# Altium project 全联供主板_V1.0.PrjPCB
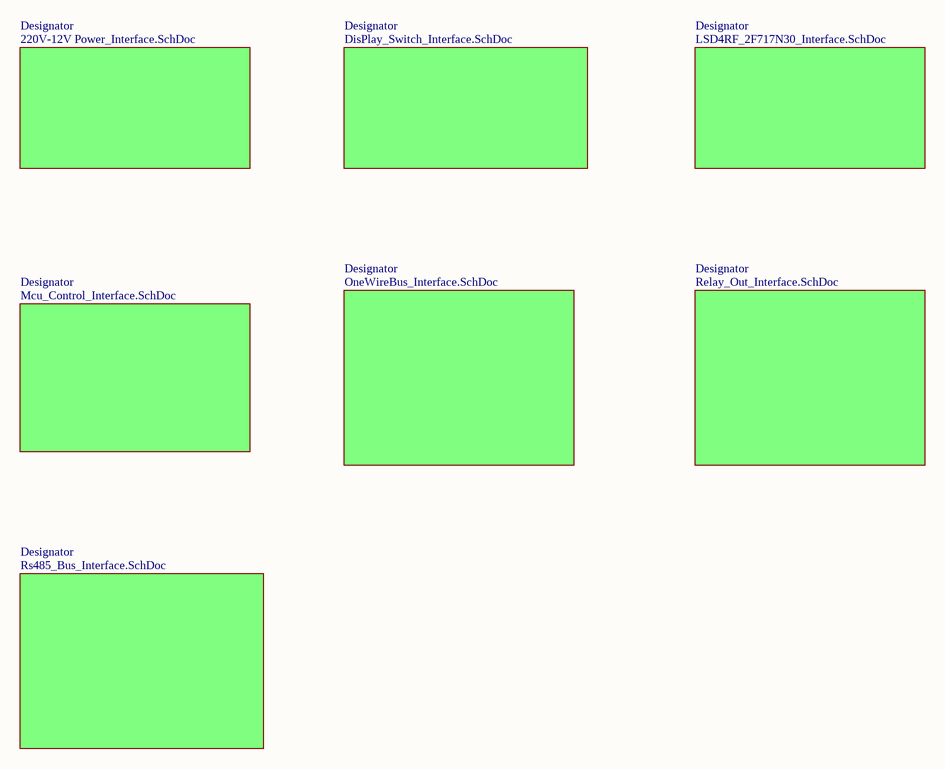
[diagram p0: 2019_Box_MainBoard_sch.SchDoc]
6 sheets, 122 parts. Net scope: global (net labels, ports and power ports of the same name join across sheets).
Board files: 10515.0462_全联供主板_V1.0.PcbDoc, 10515.0462_全联供主板(2拼版)_V1.0.PcbDoc
Sheets:
  2019_Box_MainBoard_sch.SchDoc
    Designator = 220V-12V Power_Interface.SchDoc
    Designator = DisPlay_Switch_Interface.SchDoc
    Designator = LSD4RF_2F717N30_Interface.SchDoc
    Designator = OneWireBus_Interface.SchDoc
    Designator = Rs485_Bus_Interface.SchDoc

## Sheet 2019_Box_MainBoard_sch.SchDoc
size A3

### Sub-sheets
Designator = 220V-12V Power_Interface.SchDoc: no entries
Designator = DisPlay_Switch_Interface.SchDoc: no entries
Designator = LSD4RF_2F717N30_Interface.SchDoc: no entries
Designator = Mcu_Control_Interface.SchDoc (file not in this document): no entries
Designator = OneWireBus_Interface.SchDoc: no entries
Designator = Relay_Out_Interface.SchDoc (file not in this document): no entries
Designator = Rs485_Bus_Interface.SchDoc: no entries

## Sheet 220V-12V Power_Interface.SchDoc
size A4
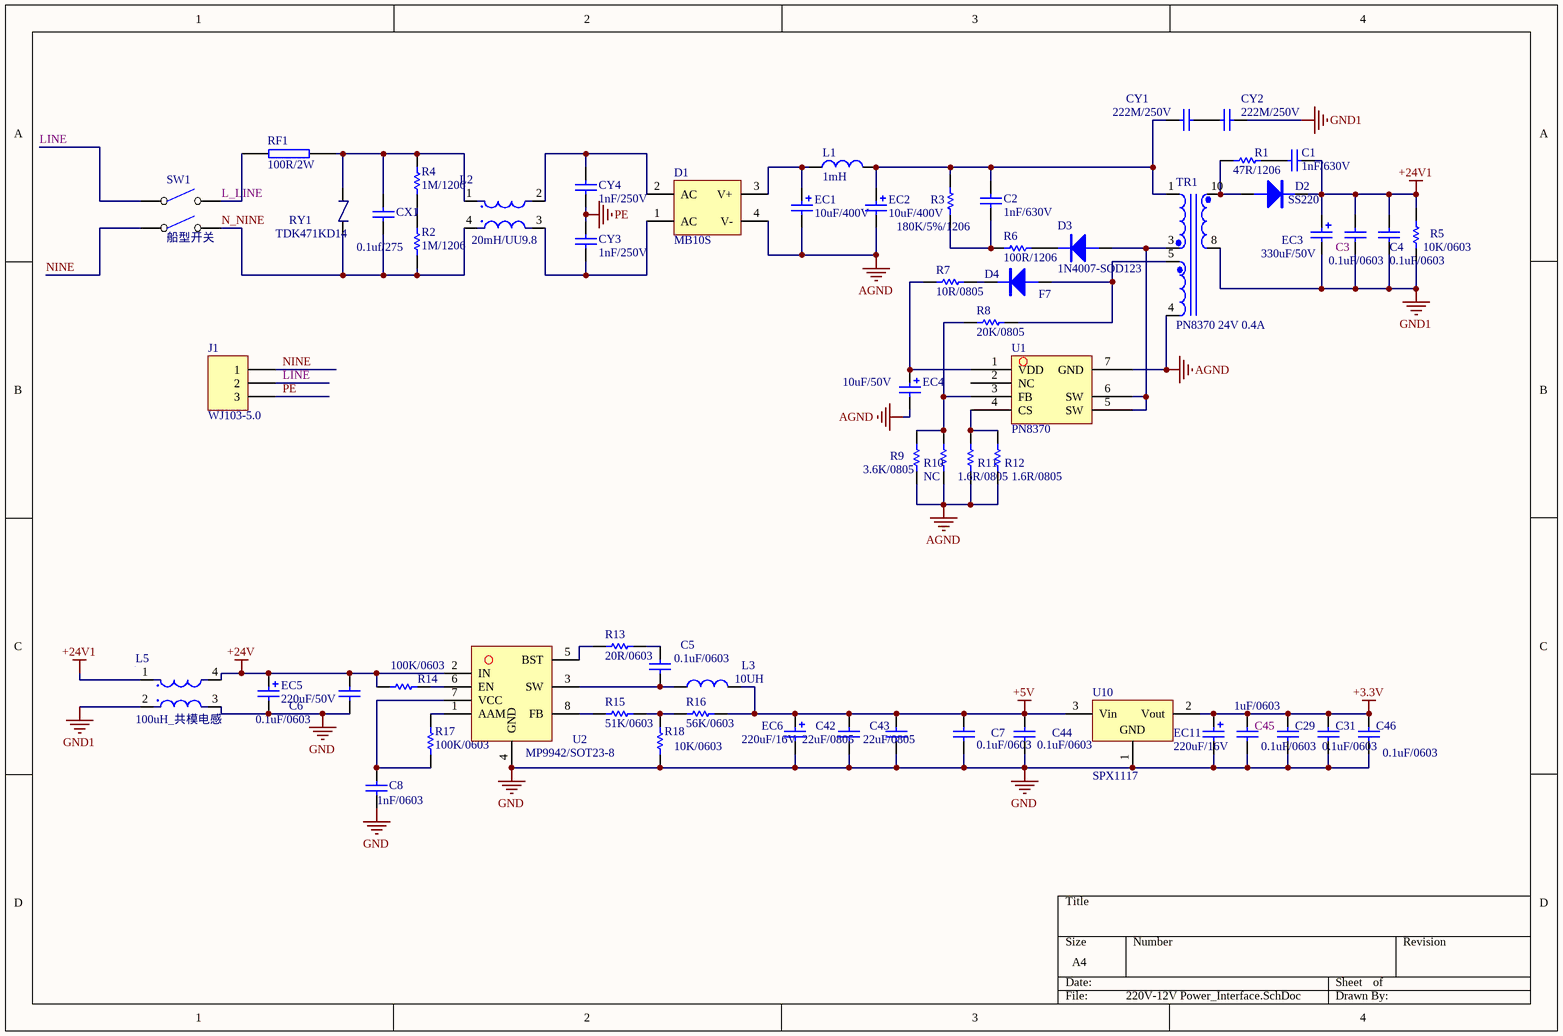
[diagram p1: 220V-12V Power_Interface.SchDoc]

### Parts
C1  1nF/630V  [CAP/SMT/1206C]
C2  1nF/630V  [CAP/SMT/1206C]
C3  0.1uF/0603  [CAP/SMT/0603C]
C4  0.1uF/0603  [CAP/SMT/0603C]
C5  0.1uF/0603  [CAP/SMT/0603C]
C6  0.1uF/0603  [CAP/SMT/0603C]
C7  0.1uF/0603  [CAP/SMT/0603C]
C8  1nF/0603  [CAP/SMT/0603C]
C29  0.1uF/0603  [CAP/SMT/0603C]
C31  0.1uF/0603  [CAP/SMT/0603C]
C42  22uF/0805  [CAP/SMT/0805C]
C43  22uF/0805  [CAP/SMT/0805C]
C44  0.1uF/0603  [CAP/SMT/0603C]
C45  1uF/0603  [CAP/SMT/0603C]
C46  0.1uF/0603  [CAP/SMT/0603C]
CX1  0.1uf/275  [CAP/DIP/0.1uF/250V]
CY1  222M/250V  [CAP/DIP/102M/250V]
CY2  222M/250V  [CAP/DIP/102M/250V]
CY3  1nF/250V  [CAP/DIP/102M/250V]
CY4  1nF/250V  [CAP/DIP/102M/250V]
D1  MB10S  [D/SMT/MD6S-TR]
D2  SS220  [D/SMT/DO-214AC]
D3  1N4007-SOD123  [D/SMT/SOD123]
D4  F7  [D/SMT/DO-214AC]
EC1  10uF/400V  [CAP/DIP/6.8UF/400V/10MM]
EC2  10uF/400V  [CAP/DIP/6.8UF/400V/10MM]
EC3  330uF/50V  [CAP/SMT/220UF/50V]
EC4  10uF/50V  [CAP/DIP/10uF/50V]
EC5  220uF/50V  [CAP/SMT/220UF/50V]
EC6  220uF/16V  [CAP/SMT/220UF/16V]
EC11  220uF/16V  [CAP/SMT/100UF/25V]
J1  WJ103-5.0  [CON/DIP/1×3PIN/5.0MM/WJ103-3P]
L1  1mH  [L/DIP/1mH]
L2  20mH/UU9.8  [L/DIP/20mH/UU9.8]
L3  10UH  [L/SMT/SWPA3015S150MT]
L5  100uH_共模电感  [L/DIP/500uH]
R1  47R/1206  [1206R]
R2  1M/1206  [1206R]
R3  180K/5%/1206  [1206R]
R4  1M/1206  [1206R]
R5  10K/0603  [0603R]
R6  100R/1206  [1206R]
R7  10R/0805  [0805R]
R8  20K/0805  [0805R]
R9  3.6K/0805  [0805R]
R10  NC  [0805R]
R11  1.6R/0805  [0805R]
R12  1.6R/0805  [0805R]
R13  20R/0603  [0603R]
R14  100K/0603  [0603R]
R15  51K/0603  [0603R]
R16  56K/0603  [0603R]
R17  100K/0603  [0603R]
R18  10K/0603  [0603R]
RF1  100R/2W  [FUSE/3.15A]
RY1  TDK471KD14  [RES/RY/TDK471KD14]
SW1  船型开关  [DIP4 - duplicate]
TR1  PN8370 24V 0.4A  [L/TRANS/DIP/PN8370 24V 0.4A]
U1  PN8370  [SOP-7]
U2  MP9942/SOT23-8  [TSOT-8]
U10  SPX1117  [SOT-223]

### Nets
+3.3V: C29.2 C31.2 C45.2 C46.2 EC11.1 U10.2(Vout)
+5V: C7.2 C42.2 C43.2 C44.2 EC6.1 L3.2 R16.2 U10.3(Vin)
+24V: C6.1 EC5.1 L5.4 R14.1 U2.2(IN)
+24V1: C1.2 C3.1 C4.1 D2.1(K) EC3.1 L5.1 R5.2
AGND: D1.4(V-) EC1.2 EC2.2 EC4.2 R9.1 R10.1 R11.1 R12.1 TR1.4 U1.7(GND)
GND: C6.2 C7.1 C8.2 C29.1 C31.1 C42.1 C43.1 C44.1 C45.1 C46.1 EC5.2 EC6.2 EC11.2 L5.3 R18.2 U2.4(GND) U10.1(GND)
GND1: C3.2 C4.2 CY2.2 EC3.2 L5.2 R5.1 TR1.8
PE: CY3.1 CY4.2 J1.3
L_LINE: RF1.2 SW1.1
LINE: J1.2 SW1.2
N_NINE: CX1.2 L2.4 R2.1 RY1.1 SW1.3
NINE: J1.1 SW1.4
NetC1_1: C1.1 R1.2
NetC2_1: C2.1 R3.1 R6.2
NetC2_2: C2.2 CY1.1 EC2.1 L1.2 R3.2 TR1.1
NetC5_1: C5.1 R13.1
NetC5_2: C5.2 L3.1 U2.3(SW)
NetC8_1: C8.1 R17.1 U2.7(VCC)
NetCX1_1: CX1.1 L2.1 R4.2 RF1.1 RY1.2
NetCY1_2: CY1.2 CY2.1
NetCY3_2: CY3.2 D1.1(AC) L2.3
NetCY4_1: CY4.1 D1.2(AC) L2.2
NetD1_3: D1.3(V+) EC1.1 L1.1
NetD2_2: D2.2(A) R1.1 TR1.10
NetD3_1: D3.1(K) R6.1
NetD3_2: D3.2(A) TR1.3 U1.5(SW) U1.6(SW)
NetD4_1: D4.1(K) R7.2
NetD4_2: D4.2(A) R8.2 TR1.5
NetEC4_1: EC4.1 R7.1 U1.1(VDD)
NetR2_2: R2.2 R4.1
NetR8_1: R8.1 R9.2 R10.2 U1.3(FB)
NetR11_2: R11.2 R12.2 U1.4(CS)
NetR13_2: R13.2 U2.5(BST)
NetR14_2: R14.2 U2.6(EN)
NetR15_1: R15.1 U2.8(FB)
NetR15_2: R15.2 R16.1 R18.1
NetR17_2: R17.2 U2.1(AAM)

Not connected (* = marked no-connect by the designer): U1 2(NC)

### Library data of the parts
C1 C2 = CAP/CAP/SMT/1206C
C3-C8 C29 C31 C44-C46 = CAP/CAP/SMT/0603C
C42 C43 = CAP/CAP/SMT/0805C
CX1 = CAP/DIP/0.1uF/275V
CY1-CY4 = CAP/DIP/102M/250V
D1 = D/BRIDGE/SMT/MB10S: D_Bridge
D2 = D/D/SMT/SS210/DO-214
D3 = D/D/SMT/1N4007-SOD123
D4 = D/D/SMT/FFM107/DO-214
EC1 EC2 = CAP/AEC/DIP/6.8uF/400V
EC3 = CAP/AEC/DIP/330uF/25V
EC4 = CAP/AEC/DIP/10uF/50V
EC5 = CAP/AEC/SMT/220uF/50V
EC6 = CAP/AEC/SMT/220uF/16V
EC11 = CAP/AEC/SMT/100uF/25V
J1 = CON/DIP/1X3PIN/WJ103-5.0MM: Connector
L1 = L/L/DIP/JYGX68-1.0mH/300mA: 工字电感
L2 = L/L/DIP/20mH: 共模电感
L3 = L/L/SMT/SWPA3015S150MT: 电感3.0MM*3.0MM*1.5MM
L5 = L/L/DIP/100uH_共模电感: 共模电感
R1-R4 R6 = RES/RES/SMT/1206
R5 R13-R18 = RES/RES/SMT/0603
R7-R12 = RES/RES/SMT/0805
RF1 = FUSE/FUSE/DIP/3.15A
RY1 = RES/RY/DIP/TDK471KD14
SW1 = SWITCH/POWER/DIP/船型开关
TR1 = L/TRANS/DIP/PN8370 24V 0.4A
U1 = IC/POWER/SMT/PN8366/SOP-8
U2 = IC/POWER/SMT/MPS2314/SOT23-8
U10 = IC/POWER/SMT/SPX1117M3-L3.3TR/SOT-223: Manufacturer: Generic Components; Class: Power Management; SubClass: Voltage Regulator; Published: 1999

## Sheet DisPlay_Switch_Interface.SchDoc
size A4
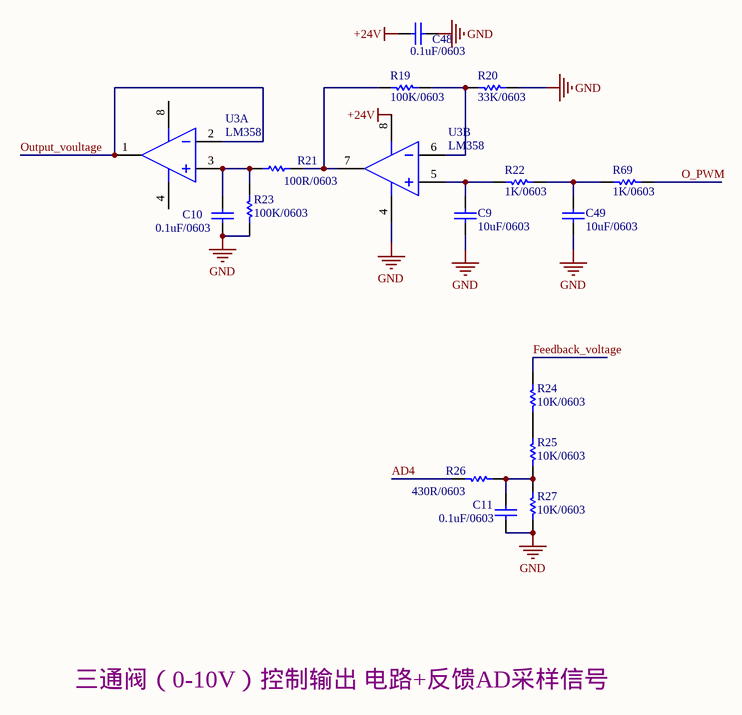
[diagram p2: DisPlay_Switch_Interface.SchDoc]

### Parts
C9  10uF/0603  [CAP/SMT/0603C]
C10  0.1uF/0603  [CAP/SMT/0603C]
C11  0.1uF/0603  [CAP/SMT/0603C]
C48  0.1uF/0603  [CAP/SMT/0603C]
C49  10uF/0603  [CAP/SMT/0603C]
R19  100K/0603  [0603R]
R20  33K/0603  [0603R]
R21  100R/0603  [0603R]
R22  1K/0603  [0603R]
R23  100K/0603  [0603R]
R24  10K/0603  [0603R]
R25  10K/0603  [0603R]
R26  430R/0603  [0603R]
R27  10K/0603  [0603R]
R69  1K/0603  [0603R]
U3  LM358  [SOIC-8]  (parts A,B of 2)

### Nets
+24V: C48.2 U3.8(VCC)
GND: C9.1 C10.1 C11.1 C48.1 C49.1 R20.1 R23.2 R27.1 U3.4(GND)
AD4: R26.1
Feedback_voltage: R24.2
O_PWM: R69.1
Output_voultage: U3.1(OUT) U3.2(IN-)
NetC9_2: C9.2 R22.2 U3.5(IN+)
NetC10_2: C10.2 R21.1 R23.1 U3.3(IN+)
NetC11_2: C11.2 R25.1 R26.2 R27.2
NetC49_2: C49.2 R22.1 R69.2
NetR19_1: R19.1 R20.2 U3.6(IN-)
NetR19_2: R19.2 R21.2 U3.7(OUT)
NetR24_1: R24.1 R25.2

### Notes on the sheet
- Labels drawn without touching a wire or pin: 三通阀（0-10V）控制输出 电路+反馈AD采样信号

### Library data of the parts
C9-C11 C48 C49 = CAP/CAP/SMT/0603C
R19-R27 R69 = RES/RES/SMT/0603
U3 = IC/OP/SMT/SGM358YS/SOIC-8: 1MHz 60uA Rail-to-Rail i/o CMOS OP; Manufacturer: ST-Microelectronics; Class: Analog; SubClass: Comparator; Published: 24/08/2001; Publisher: Altium Hobart Technology Centre

## Sheet LSD4RF_2F717N30_Interface.SchDoc
size A4
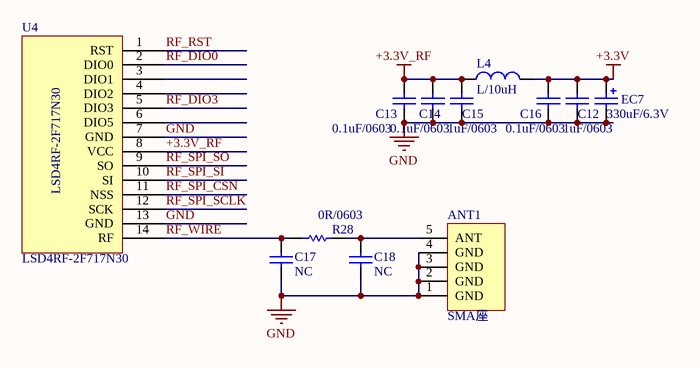
[diagram p3: LSD4RF_2F717N30_Interface.SchDoc]

### Parts
ANT1  SMA座  [SMA]
C12  1uF/0603  [CAP/SMT/0603C]
C13  0.1uF/0603  [CAP/SMT/0603C]
C14  0.1uF/0603  [CAP/SMT/0603C]
C15  1uF/0603  [CAP/SMT/0603C]
C16  0.1uF/0603  [CAP/SMT/0603C]
C17  NC  [CAP/SMT/0603C]
C18  NC  [CAP/SMT/0603C]
EC7  330uF/6.3V  [CAP/SMT/330UF/6.3V]
L4  L/10uH  [L/SMT/0603L]
R28  0R/0603  [0603R]
U4  LSD4RF-2F717N30  [MODEL/LSD4RF-2F717N30]

### Nets
+3.3V: C12.2 C16.1 EC7.1 L4.2
+3.3V_RF: C13.1 C14.1 C15.1 L4.1 U4.8(VCC)
GND: ANT1.1(GND) ANT1.2(GND) ANT1.3(GND) ANT1.4(GND) C12.1 C13.2 C14.2 C15.2 C16.2 C17.1 C18.1 EC7.2 U4.7(GND) U4.13(GND)
RF_DIO0: U4.2(DIO0)
RF_DIO3: U4.5(DIO3)
RF_RST: U4.1(RST)
RF_SPI_CSN: U4.11(NSS)
RF_SPI_SCLK: U4.12(SCK)
RF_SPI_SI: U4.10(SI)
RF_SPI_SO: U4.9(SO)
RF_WIRE: C17.2 R28.1 U4.14(RF)
NetANT1_5: ANT1.5(ANT) C18.2 R28.2

Not connected (* = marked no-connect by the designer): U4 3(DIO1) 4(DIO2) 6(DIO5)

### Library data of the parts
ANT1 = OTHER/Antena/SMA座
C12-C18 = CAP/CAP/SMT/0603C
EC7 = CAP/AEC/SMT/330uF/6.3V
L4 = L/BEAD/SMT/0603L
R28 = RES/RES/SMT/0603
U4 = MODLE/RF/LSD4RF-2F717N30

## Sheet OneWireBus_Interface.SchDoc
size A4
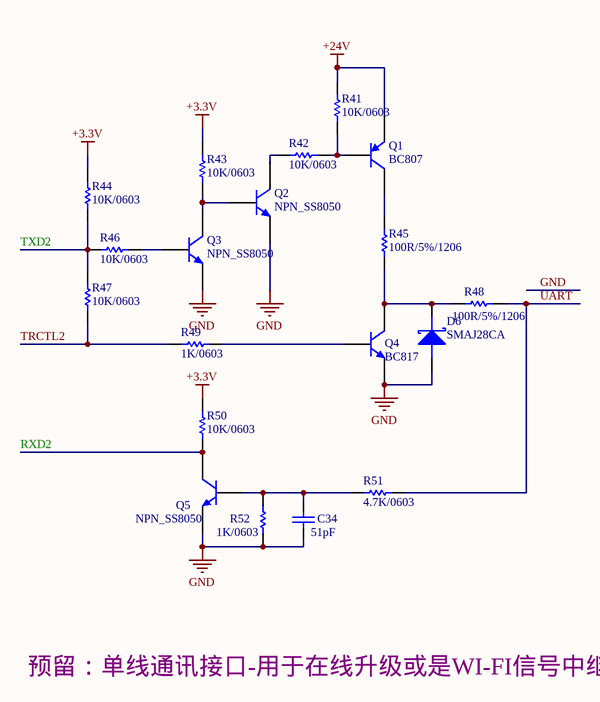
[diagram p4: OneWireBus_Interface.SchDoc]

### Parts
C34  51pF  [CAP/SMT/0603C]
D6  SMAJ28CA  [D/SMT/SMBJ4.0A]
Q1  BC807  [BJT/SMT/SOT-23]
Q2  NPN_SS8050  [BJT/SMT/SOT-23]
Q3  NPN_SS8050  [BJT/SMT/SOT-23]
Q4  BC817  [BJT/SMT/SOT-23]
Q5  NPN_SS8050  [BJT/SMT/SOT-23]
R41  10K/0603  [0603R]
R42  10K/0603  [0603R]
R43  10K/0603  [0603R]
R44  10K/0603  [0603R]
R45  100R/5%/1206  [1206R]
R46  10K/0603  [0603R]
R47  10K/0603  [0603R]
R48  100R/5%/1206  [1206R]
R49  1K/0603  [0603R]
R50  10K/0603  [0603R]
R51  4.7K/0603  [0603R]
R52  1K/0603  [0603R]

### Nets
+3.3V: R43.2 R44.1 R50.2
+24V: Q1.2(E) R41.2
GND: C34.1 D6.1(K) Q2.2(E) Q3.2(E) Q4.2(E) Q5.2(E) R52.2
RXD2: Q5.3(C) R50.1
TRCTL2: R47.2 R49.2
TXD2: R44.2 R46.2 R47.1
UART: R48.1 R51.2
NetC34_2: C34.2 Q5.1(B) R51.1 R52.1
NetD6_2: D6.2(A) Q4.3(C) R45.1 R48.2
NetQ1_1: Q1.1(B) R41.1 R42.1
NetQ1_3: Q1.3(C) R45.2
NetQ2_1: Q2.1(B) Q3.3(C) R43.1
NetQ2_3: Q2.3(C) R42.2
NetQ3_1: Q3.1(B) R46.1
NetQ4_1: Q4.1(B) R49.1

### Notes on the sheet
- Labels drawn without touching a wire or pin: 预留：单线通讯接口-用于在线升级或是WI-FI信号中继

### Library data of the parts
C34 = A_Cap_0805: Manufacturer: Generic Components; Class: Passive; SubClass: Capacitor; Value: 100pF; Published: 08/06/2000; Publisher: Altium Hobart Technology Centre
D6 = D/TVS/SMT/SMBJ6.5A/DO-214
Q1 = PNP: PNP Bipolar Transistor; Published: 8-Jun-2000; LatestRevisionDate: 29-May-2009; LatestRevisionNote: IPC-7351 Footprint Added.; PackageVersion: Aug-1999; PackageReference: SOT-23B; Publisher: Altium Limited; PackageDescription: 3-Pin SOT-23 Package 0.95 mm Pitch, 2.4 mm Lead Span
Q2-Q5 = BJT/NPN/SMT/SS8050/SOT-23: Vce25V/Vcb40V/Veb5V/Ic1.5V/Pd300mW; Published: *; Publisher: *; Manufacturer: *; Class: *; SubClass: *
R41-R44 R46 R47 R49-R52 = A_Res_0805: Resistor; Manufacturer: Generic Components; Class: Passive; Value: 1K; Published: 08/06/2000; Publisher: Altium Hobart Technology Centre; SubClass: Resistor
R45 R48 = RES/RES/SMT/1206

## Sheet Rs485_Bus_Interface.SchDoc
size A4
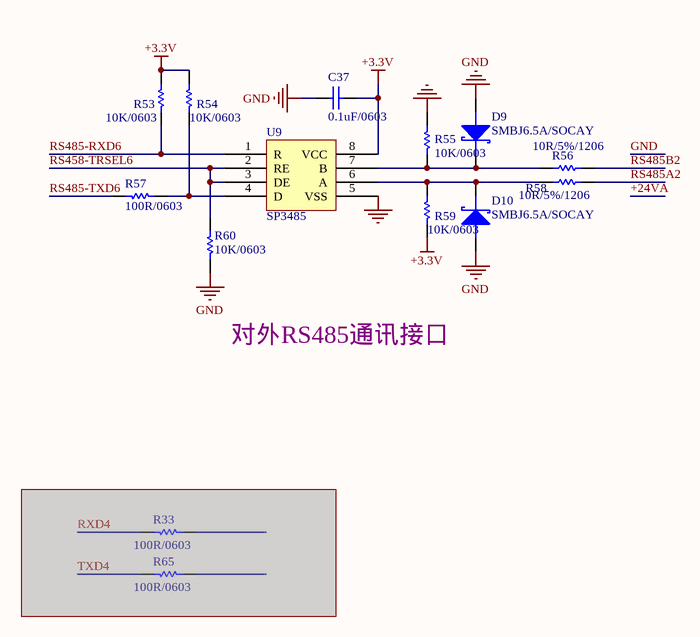
[diagram p5: Rs485_Bus_Interface.SchDoc]

### Parts
C37  0.1uF/0603  [CAP/SMT/0603C]
D9  SMBJ6.5A/SOCAY  [D/SMT/SMBJ4.0A]
D10  SMBJ6.5A/SOCAY  [D/SMT/SMBJ4.0A]
R33  100R/0603  [0603R]  (masked out: inside a compile mask, not in the netlist)
R53  10K/0603  [0603R]
R54  10K/0603  [0603R]
R55  10K/0603  [0603R]
R56  10R/5%/1206  [1206R]
R57  100R/0603  [0603R]
R58  10R/5%/1206  [1206R]
R59  10K/0603  [0603R]
R60  10K/0603  [0603R]
R65  100R/0603  [0603R]  (masked out: inside a compile mask, not in the netlist)
U9  SP3485  [SOP-8]

### Nets
+3.3V: C37.2 R53.2 R54.2 R59.2 U9.8(VCC)
GND: C37.1 D9.1(K) D10.1(K) R55.1 R60.1 U9.5(VSS)
RS458-TRSEL6: R60.2 U9.2(RE) U9.3(DE)
RS485-RXD6: R53.1 U9.1(R)
RS485-TXD6: R57.2
RS485A2: R58.2
RS485B2: R56.2
NetD9_2: D9.2(A) R55.2 R56.1 U9.7(B)
NetD10_2: D10.2(A) R58.1 R59.1 U9.6(A)
NetR54_1: R54.1 R57.1 U9.4(D)

### Notes on the sheet
- Labels drawn without touching a wire or pin: 对外RS485通讯接口

### Library data of the parts
C37 = CAP/CAP/SMT/0603C
D9 D10 = D/TVS/SMT/SMBJ6.5A/DO-214
R33 R53-R55 R57 R59 R60 R65 = Res1: Resistor; Manufacturer: Generic Components; Class: Passive; Value: 1K; Published: 08/06/2000; Publisher: Altium Hobart Technology Centre; SubClass: Resistor
R56 R58 = RES/RES/SMT/1206
U9 = MAX487

## Nets that join several sheets
+3.3V: 220V-12V Power_Interface (6 pins), LSD4RF_2F717N30_Interface (C12.2 C16.1 EC7.1 L4.2), OneWireBus_Interface (R43.2 R44.1 R50.2), Rs485_Bus_Interface (5 pins)
+24V: 220V-12V Power_Interface (5 pins), DisPlay_Switch_Interface (C48.2 U3.8), OneWireBus_Interface (Q1.2 R41.2)
GND: 220V-12V Power_Interface (17 pins), DisPlay_Switch_Interface (9 pins), LSD4RF_2F717N30_Interface (14 pins), OneWireBus_Interface (7 pins), Rs485_Bus_Interface (6 pins)